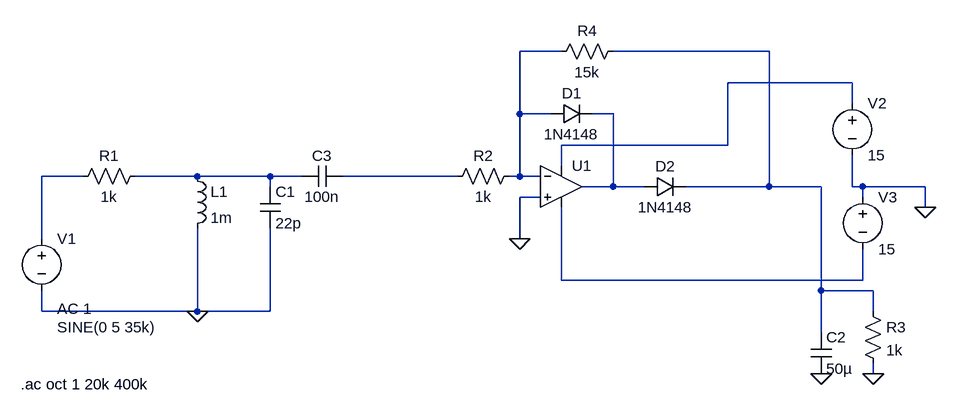
[diagram p0: schematic Nisal-INVENSION.asc]
Nisal-INVENSION.asc, the LTspice schematic file:
Version 4
SHEET 1 1348 680
WIRE 768 -48 704 -48
WIRE 1088 -48 848 -48
WIRE 1216 0 1024 0
WIRE 1216 32 1216 0
WIRE 704 48 704 -48
WIRE 752 48 704 48
WIRE 848 48 816 48
WIRE 1024 96 1024 0
WIRE 1024 96 768 96
WIRE 768 128 768 96
WIRE 32 144 -32 144
WIRE 208 144 112 144
WIRE 320 144 208 144
WIRE 368 144 320 144
WIRE 608 144 432 144
WIRE 704 144 704 48
WIRE 704 144 688 144
WIRE 736 144 704 144
WIRE 320 160 320 144
WIRE 848 160 848 48
WIRE 848 160 800 160
WIRE 896 160 848 160
WIRE 1088 160 1088 -48
WIRE 1088 160 960 160
WIRE 1168 160 1088 160
WIRE 1216 160 1216 112
WIRE 1232 160 1216 160
WIRE 1328 160 1232 160
WIRE 736 176 704 176
WIRE 1232 176 1232 160
WIRE 1328 192 1328 160
WIRE -32 240 -32 144
WIRE 704 240 704 176
WIRE 768 304 768 192
WIRE 1232 304 1232 256
WIRE 1232 304 768 304
WIRE 1168 320 1168 160
WIRE 1248 320 1168 320
WIRE -32 352 -32 320
WIRE 208 352 208 224
WIRE 208 352 -32 352
WIRE 320 352 320 224
WIRE 320 352 208 352
WIRE 1248 352 1248 320
WIRE 1168 384 1168 320
WIRE 1248 448 1248 432
FLAG 208 352 0
FLAG 704 240 0
FLAG 1328 192 0
FLAG 1168 448 0
FLAG 1248 448 0
SYMBOL ind 192 128 R0
SYMATTR InstName L1
SYMATTR Value 1m
SYMBOL cap 304 160 R0
SYMATTR InstName C1
SYMATTR Value 22p
SYMBOL res 128 128 R90
WINDOW 0 0 56 VBottom 2
WINDOW 3 32 56 VTop 2
SYMATTR InstName R1
SYMATTR Value 1k
SYMBOL voltage -32 224 R0
WINDOW 3 24 152 Left 2
WINDOW 123 24 124 Left 2
WINDOW 39 0 0 Left 0
SYMATTR InstName V1
SYMATTR Value SINE(0 5 35k)
SYMATTR Value2 AC 1
SYMBOL cap 432 128 R90
WINDOW 0 0 32 VBottom 2
WINDOW 3 32 32 VTop 2
SYMATTR InstName C3
SYMATTR Value 100n
SYMBOL res 704 128 R90
WINDOW 0 0 56 VBottom 2
WINDOW 3 32 56 VTop 2
SYMATTR InstName R2
SYMATTR Value 1k
SYMBOL res 864 -64 R90
WINDOW 0 0 56 VBottom 2
WINDOW 3 32 56 VTop 2
SYMATTR InstName R4
SYMATTR Value 15k
SYMBOL diode 752 64 R270
WINDOW 0 32 32 VTop 2
WINDOW 3 0 32 VBottom 2
SYMATTR InstName D1
SYMATTR Value 1N4148
SYMBOL diode 896 176 R270
WINDOW 0 32 32 VTop 2
WINDOW 3 0 32 VBottom 2
SYMATTR InstName D2
SYMATTR Value 1N4148
SYMBOL voltage 1216 16 R0
WINDOW 123 0 0 Left 0
WINDOW 39 0 0 Left 0
SYMATTR InstName V2
SYMATTR Value 15
SYMBOL voltage 1232 160 R0
WINDOW 123 0 0 Left 0
WINDOW 39 0 0 Left 0
SYMATTR InstName V3
SYMATTR Value 15
SYMBOL OpAmps\\UniversalOpAmp1 768 160 R0
SYMATTR InstName U1
SYMBOL cap 1152 384 R0
SYMATTR InstName C2
SYMATTR Value 50µ
SYMBOL res 1232 336 R0
SYMATTR InstName R3
SYMATTR Value 1k
TEXT -64 464 Left 2 !.ac oct 1 20k 400k

The netlist it stands for:
* Nisal-INVENSION.asc
L1 N006 0 1m
C1 N006 0 22p
R1 N006 N005 1k
V1 N005 0 SINE(0 5 35k) AC 1
C3 N007 N006 100n
R2 N001 N007 1k
R4 N002 N001 15k
D1 N001 N004 1N4148
D2 N004 N002 1N4148
V2 N003 0 15
V3 0 N008 15
XU1 0 N001 N003 N008 N004 level1 Avol=1Meg GBW=10Meg Vos=0 En=0 Enk=0 In=0 Ink=0 Rin=500Meg  ; pins In+ In- V+ V- OUT
C2 N002 0 50µ
R3 N002 0 1k
.model D D
.lib standard.dio
.ac oct 1 20k 400k
.lib UniversalOpAmp1.lib
.backanno
.end